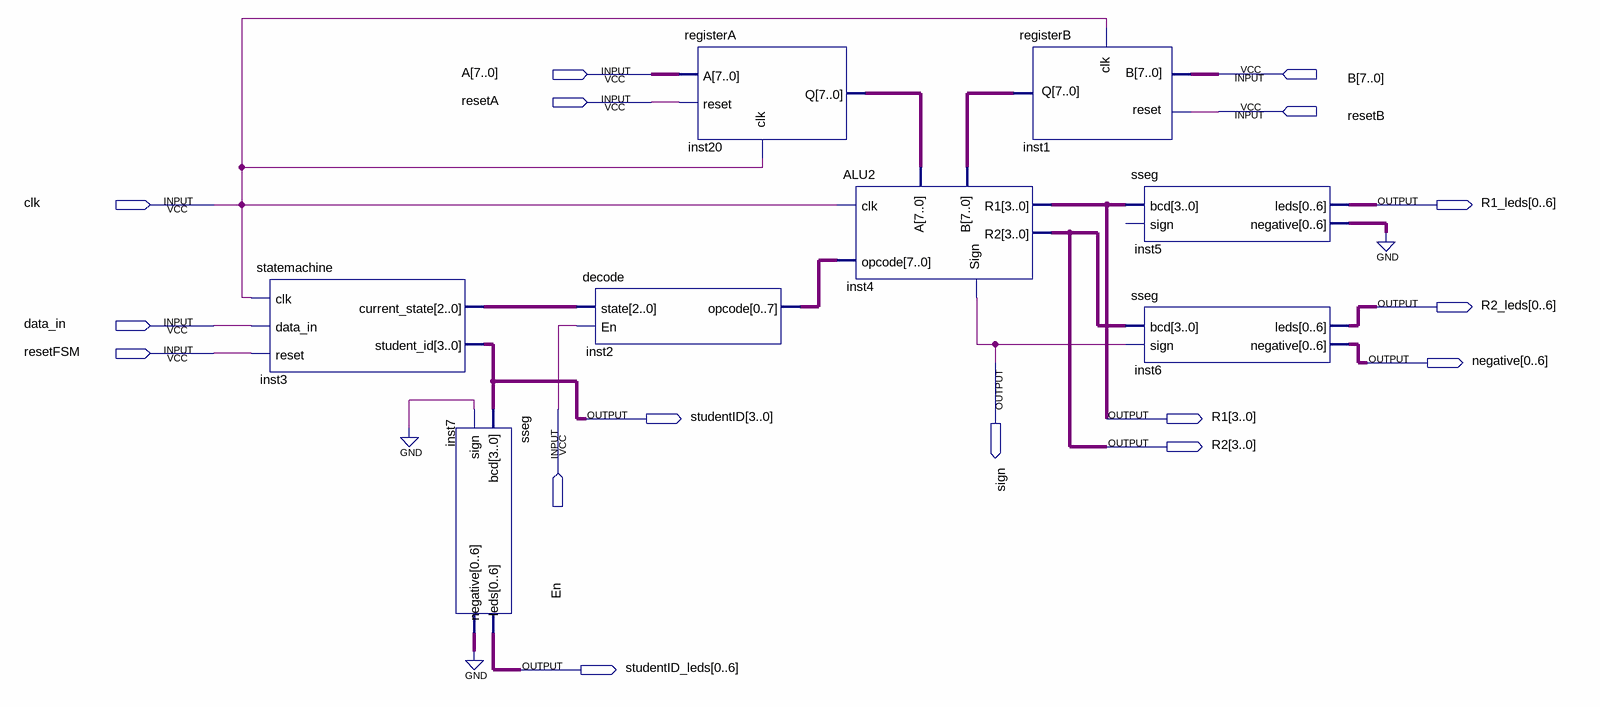
[diagram p0: schematic sheet]
// Quartus schematic lab6block2.bdf as structural Verilog: 8 symbols, 16 pins
module lab6block2 (
  input  [7:0] A,
  input  [7:0] B,
  input  resetA,
  input  resetB,
  input  clk,
  input  data_in,
  input  resetFSM,
  input  En,
  output [0:6] R1_leds,
  output [0:6] R2_leds,
  output sign,
  output [0:6] negative,
  output [3:0] studentID,
  output [3:0] R1,
  output [3:0] R2,
  output [0:6] studentID_leds
);

  wire [2:0] inst3_current_state;
  wire [6:0] inst5_negative, inst7_negative;
  wire [7:0] inst1_q, inst2_opcode, inst20_q;

  statemachine inst3 (
    .data_in(data_in), .clk(clk), .reset(resetFSM), .student_id(studentID),
    .current_state(inst3_current_state));
  sseg inst7 (.bcd(studentID), .sign(1'b0), .leds(studentID_leds), .negative(inst7_negative));
  decode inst2 (.state(inst3_current_state), .En(En), .opcode(inst2_opcode));
  registerA inst20 (.A(A), .reset(resetA), .clk(clk), .Q(inst20_q));
  ALU2 inst4 (.clk(clk), .A(inst20_q), .B(inst1_q), .opcode(inst2_opcode), .R1(R1), .R2(R2), .Sign(sign));
  registerB inst1 (.B(B), .reset(resetB), .clk(clk), .Q(inst1_q));
  sseg inst5 (.bcd(R1), .leds(R1_leds), .negative(inst5_negative));  // open: sign
  sseg inst6 (.bcd(R2), .sign(sign), .leds(R2_leds), .negative(negative));
  // also tied to GND on the sheet: {inst5_negative[0], inst5_negative[1], inst5_negative[2], inst5_negative[3], inst5_negative[4], inst5_negative[5], inst5_negative[6], inst7_negative[0], inst7_negative[1], inst7_negative[2], inst7_negative[3], inst7_negative[4], inst7_negative[5], inst7_negative[6]}
endmodule
